# EAGLE schematic board (EAGLE 9.2.0)
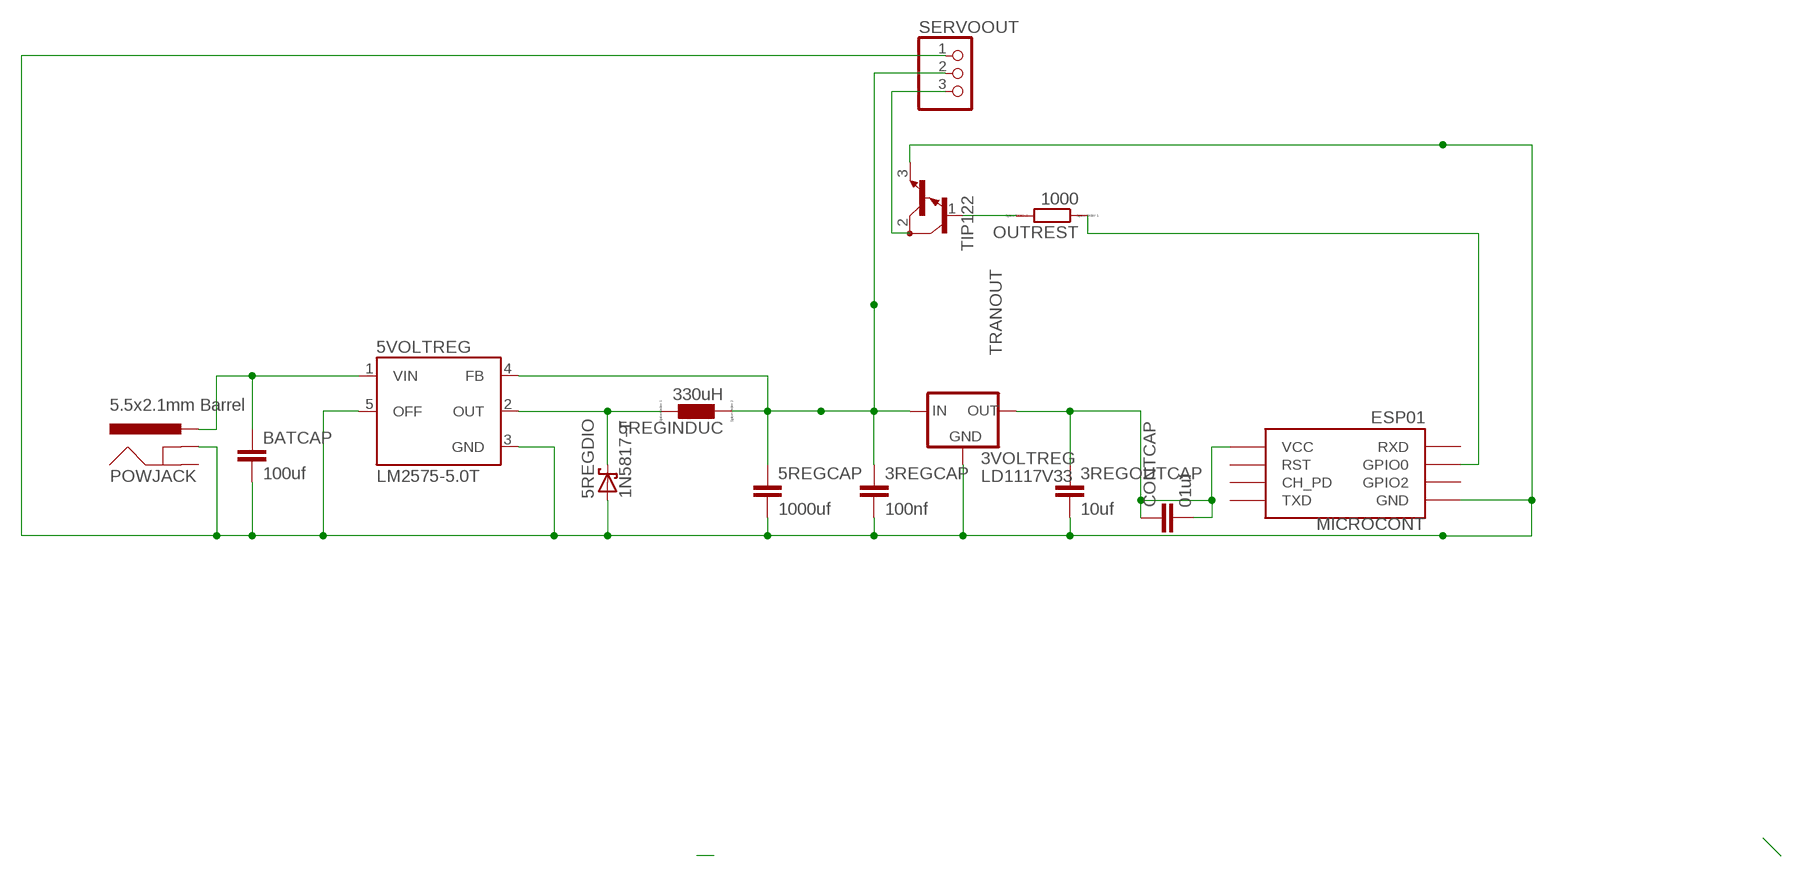
[diagram p0: schematic, sheet 1]

## Parts
3REGCAP  100nf  C5/2.5  [C5B2.5]
3REGOUTCAP  10uf  C5/2.5  [C5B2.5]
3VOLTREG  LD1117V33  [LD1117V33]
5REGCAP  1000uf  C5/2.5  [C5B2.5]
5REGDIO  1N5817-T  [DO41-7.6]
5REGINDUC  330uH  L0204/7  [0204/7]
5VOLTREG  LM2575-5.0T  [TO220-5]
BATCAP  100uf  C5/2.5  [C5B2.5]
CONTCAP  01uf  C5/2.5  [C5B2.5]
MICROCONT  ESP01  [ESP01]
OUTREST  1000  R0207/10  [0207/10]
POWJACK  5.5x2.1mm Barrel  POWER_JACKSMD  [POWER_JACK_SMD]
SERVOOUT  PINHD-1X3  [1X03]
TRANOUT  TIP122  [TO220]

## Nets
GND: 3REGCAP.2 3REGOUTCAP.2 3VOLTREG.GND 5REGCAP.2 5REGDIO.A 5VOLTREG.3(GND) 5VOLTREG.5(OFF) BATCAP.2 MICROCONT.GND POWJACK.GND(GNDBREAK) SERVOOUT.1 TRANOUT.3(E)
N$1: 5VOLTREG.1(VIN) BATCAP.1 POWJACK.VIN0(PWR)
N$3: 5REGDIO.C 5REGINDUC.1 5VOLTREG.2(OUT)
N$5: 3REGCAP.1 3VOLTREG.IN 5REGCAP.1 5REGINDUC.2 5VOLTREG.4(FB) SERVOOUT.2
N$7: 3REGOUTCAP.1 3VOLTREG.OUT CONTCAP.1 CONTCAP.2 MICROCONT.VCC
N$8: OUTREST.2 TRANOUT.1(B)
N$9: MICROCONT.GPIO0 OUTREST.1
N$10: SERVOOUT.3 TRANOUT.2(C)
Unconnected: MICROCONT.CH_PD MICROCONT.GPIO2 MICROCONT.RST MICROCONT.RX(RXD) MICROCONT.TX(TXD) POWJACK.P$4(GND)

## Library data of the parts
3REGCAP 3REGOUTCAP 5REGCAP BATCAP CONTCAP = capacitor-wima:C: CAPACITOR naming: grid - package width
3VOLTREG = LD1117V33:LD1117V33
5REGDIO = _mod_diode:1N581*: 1.0A SCHOTTKY BARRIER RECTIFIER Source: http://www.diodes.com/datasheets/ds23001.pdf
5REGINDUC = eagle-ltspice:L: INDUCTOR, European symbol; SPICEMODEL: NONE; SPICEPREFIX: L
5VOLTREG = lm2575:LM2575-5.0: National Semiconductor <http://www.national.com> 1.0A "Simple Switcher"(c) 52kHz, Vout 1.23-37V (HV: 57V), Vin 40V (HV: 60V), 50µA standby current
MICROCONT = esp8266modules:ESP01: ESP8266 Wifi module 01
OUTREST = eagle-ltspice:R: RESISTOR, European symbol; SPICEMODEL: NONE; SPICEPREFIX: R
POWJACK = SparkFun-Connectors:POWER_JACK: Power Jack Connector This is the standard 5.5mm barrel jack for power. The PTH is the most common, proven, reliable, footprint. The Slot footprint only works if the mill layer is transmitted to the PCB fab house so be warned. Here are the connectors we sell at SparkFun: DC Barrel Power Jack/Connector <https://www.sparkfun.com/products/119> (PRT-00119) DC Barrel Power Jack/Connector (SMD) <https://www.sparkfun.com/products/12748> (PRT-12748) DC Barrel Jack Adapter - Breadboard Compatible <https://www.sparkfun.com/products/10811> (PRT-10811) It is used on this SparkFun product (and many, many others): SparkFun RedBoard - Programmed with Arduino <https://www.sparkfun.com/products/12757> (DEV-12757) Also, if you need a mating power supply or connector, please check these out: Wall Adapter Power Supply - 9VDC 650mA <https://www.sparkfun.com/products/298> (TOL-00298) DC Barrel Jack Adapter - Male <https://www.sparkfun.com/products/10287> (PRT-10287); PROD_ID: CONN-08106; SF_ID: PRT-12748
SERVOOUT = pinhead:PINHD-1X3: PIN HEADER
TRANOUT = transistor:TIP122: NPN BIPOLAR DARLINGTON TRANSISTOR